# EAGLE design interface_board (2) (EAGLE 6.1)

## Sheet 1 of 4
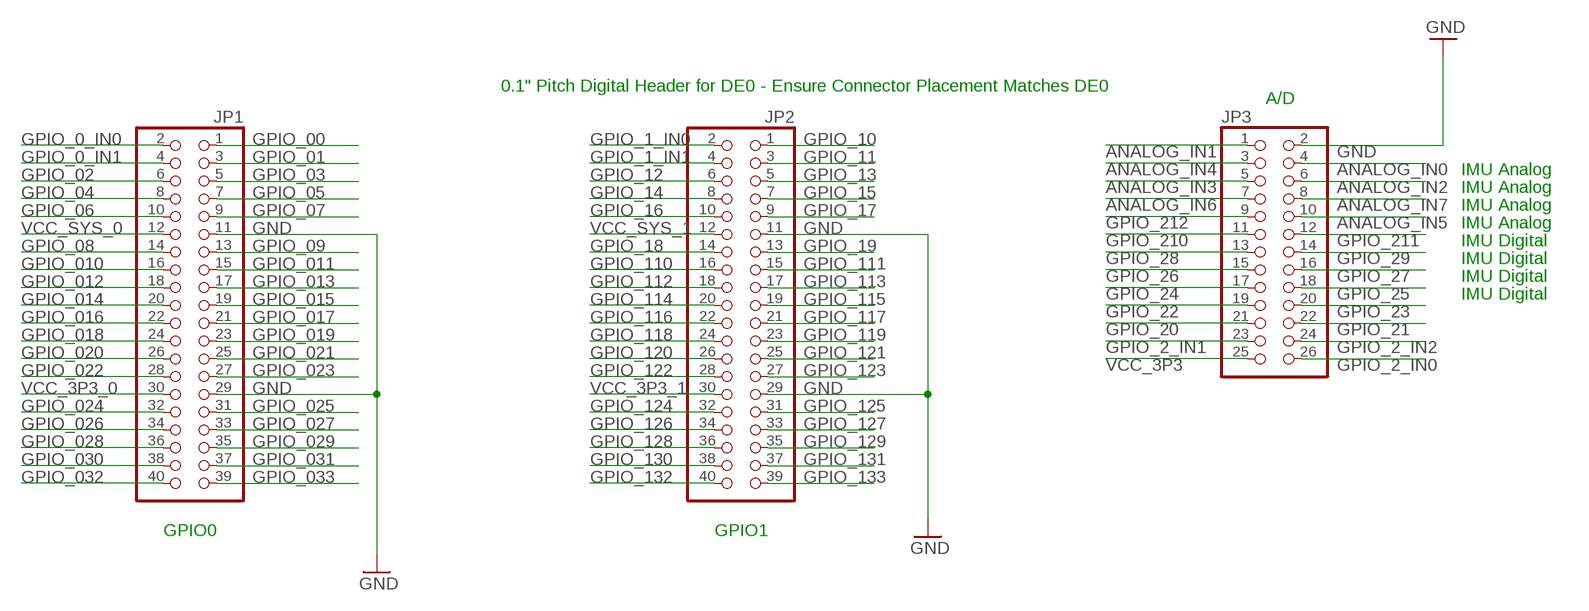
[diagram p0: schematic, sheet 1]

### Parts
JP1  PINHD-2X20  [2X20]
JP2  PINHD-2X20  [2X20]
JP3  PINHD-2X13  [2X13]

### Nets
ANALOG_IN0: JP3.4 ; also sheet 2,3
ANALOG_IN1: JP3.1 ; also sheet 2
ANALOG_IN2: JP3.6 ; also sheet 2,3
ANALOG_IN3: JP3.5 ; also sheet 2
ANALOG_IN4: JP3.3 ; also sheet 2
ANALOG_IN5: JP3.10 ; also sheet 2,3
ANALOG_IN6: JP3.7 ; also sheet 2
ANALOG_IN7: JP3.8 ; also sheet 2,3
GND: JP1.11 JP1.29 JP2.11 JP2.29 JP3.2 ; also sheet 2,3,4
GPIO_00: JP1.1 ; also sheet 2,4
GPIO_0_IN0: JP1.2 ; also sheet 2,4
GPIO_0_IN1: JP1.4 ; also sheet 2
GPIO_01: JP1.3 ; also sheet 2
GPIO_1_IN0: JP2.2 ; also sheet 2
GPIO_1_IN1: JP2.4 ; also sheet 2
GPIO_02: JP1.6 ; also sheet 2
GPIO_2_IN0: JP3.26 ; also sheet 2
GPIO_2_IN1: JP3.23 ; also sheet 2
GPIO_2_IN2: JP3.24 ; also sheet 2
GPIO_03: JP1.5 ; also sheet 2
GPIO_04: JP1.8 ; also sheet 2
GPIO_05: JP1.7 ; also sheet 2
GPIO_06: JP1.10 ; also sheet 2
GPIO_07: JP1.9 ; also sheet 2
GPIO_08: JP1.14 ; also sheet 2
GPIO_09: JP1.13 ; also sheet 2
GPIO_010: JP1.16 ; also sheet 2
GPIO_10: JP2.1 ; also sheet 2
GPIO_011: JP1.15 ; also sheet 2
GPIO_11: JP2.3 ; also sheet 2
GPIO_012: JP1.18 ; also sheet 2
GPIO_12: JP2.6 ; also sheet 2
GPIO_013: JP1.17 ; also sheet 2
GPIO_13: JP2.5 ; also sheet 2
GPIO_014: JP1.20 ; also sheet 2
GPIO_14: JP2.8 ; also sheet 2
GPIO_015: JP1.19 ; also sheet 2
GPIO_15: JP2.7 ; also sheet 2
GPIO_016: JP1.22 ; also sheet 2
GPIO_16: JP2.10 ; also sheet 2
GPIO_017: JP1.21 ; also sheet 2
GPIO_17: JP2.9 ; also sheet 2
GPIO_018: JP1.24 ; also sheet 2
GPIO_18: JP2.14 ; also sheet 2
GPIO_019: JP1.23 ; also sheet 2
GPIO_19: JP2.13 ; also sheet 2
GPIO_020: JP1.26 ; also sheet 2
GPIO_20: JP3.21 ; also sheet 2
GPIO_021: JP1.25 ; also sheet 2
GPIO_21: JP3.22 ; also sheet 2
GPIO_022: JP1.28 ; also sheet 2
GPIO_22: JP3.19 ; also sheet 2
GPIO_023: JP1.27 ; also sheet 2
GPIO_23: JP3.20 ; also sheet 2
GPIO_024: JP1.32 ; also sheet 2
GPIO_24: JP3.17 ; also sheet 2
GPIO_025: JP1.31 ; also sheet 2
GPIO_25: JP3.18 ; also sheet 2,3
GPIO_026: JP1.34 ; also sheet 2
GPIO_26: JP3.15 ; also sheet 2
GPIO_027: JP1.33 ; also sheet 2
GPIO_27: JP3.16 ; also sheet 2,3
GPIO_028: JP1.36 ; also sheet 2
GPIO_28: JP3.13 ; also sheet 2
GPIO_029: JP1.35 ; also sheet 2
GPIO_29: JP3.14 ; also sheet 2,3
GPIO_030: JP1.38 ; also sheet 2
GPIO_031: JP1.37 ; also sheet 2
GPIO_032: JP1.40 ; also sheet 2
GPIO_033: JP1.39 ; also sheet 2
GPIO_110: JP2.16 ; also sheet 2
GPIO_111: JP2.15 ; also sheet 2
GPIO_112: JP2.18 ; also sheet 2
GPIO_113: JP2.17 ; also sheet 2
GPIO_114: JP2.20 ; also sheet 2
GPIO_115: JP2.19 ; also sheet 2
GPIO_116: JP2.22 ; also sheet 2
GPIO_117: JP2.21 ; also sheet 2
GPIO_118: JP2.24 ; also sheet 2
GPIO_119: JP2.23 ; also sheet 2
GPIO_120: JP2.26 ; also sheet 2
GPIO_121: JP2.25 ; also sheet 2
GPIO_122: JP2.28 ; also sheet 2
GPIO_123: JP2.27 ; also sheet 2
GPIO_124: JP2.32 ; also sheet 2,4
GPIO_125: JP2.31 ; also sheet 4
GPIO_126: JP2.34 ; also sheet 3
GPIO_127: JP2.33 ; also sheet 4
GPIO_128: JP2.36 ; also sheet 3
GPIO_129: JP2.35 ; also sheet 4
GPIO_130: JP2.38 ; also sheet 3
GPIO_131: JP2.37 ; also sheet 4
GPIO_132: JP2.40 ; also sheet 3
GPIO_133: JP2.39 ; also sheet 4
GPIO_210: JP3.11 ; also sheet 2
GPIO_211: JP3.12 ; also sheet 2,3
GPIO_212: JP3.9 ; also sheet 2
VCC_3P3: JP3.25 ; also sheet 3
VCC_3P3_0: JP1.30
VCC_3P3_1: JP2.30 ; also sheet 4
VCC_SYS_0: JP1.12
VCC_SYS_1: JP2.12

### Notes on the sheet
- 0.1" Pitch Digital Header for DE0 - Ensure Connector Placement Matches DE0 | A/D
- IMU Analog
- IMU Analog
- IMU Analog
- IMU Analog
- IMU Digital
- IMU Digital
- IMU Digital
- IMU Digital
- GPIO0 | GPIO1

## Sheet 2 of 4
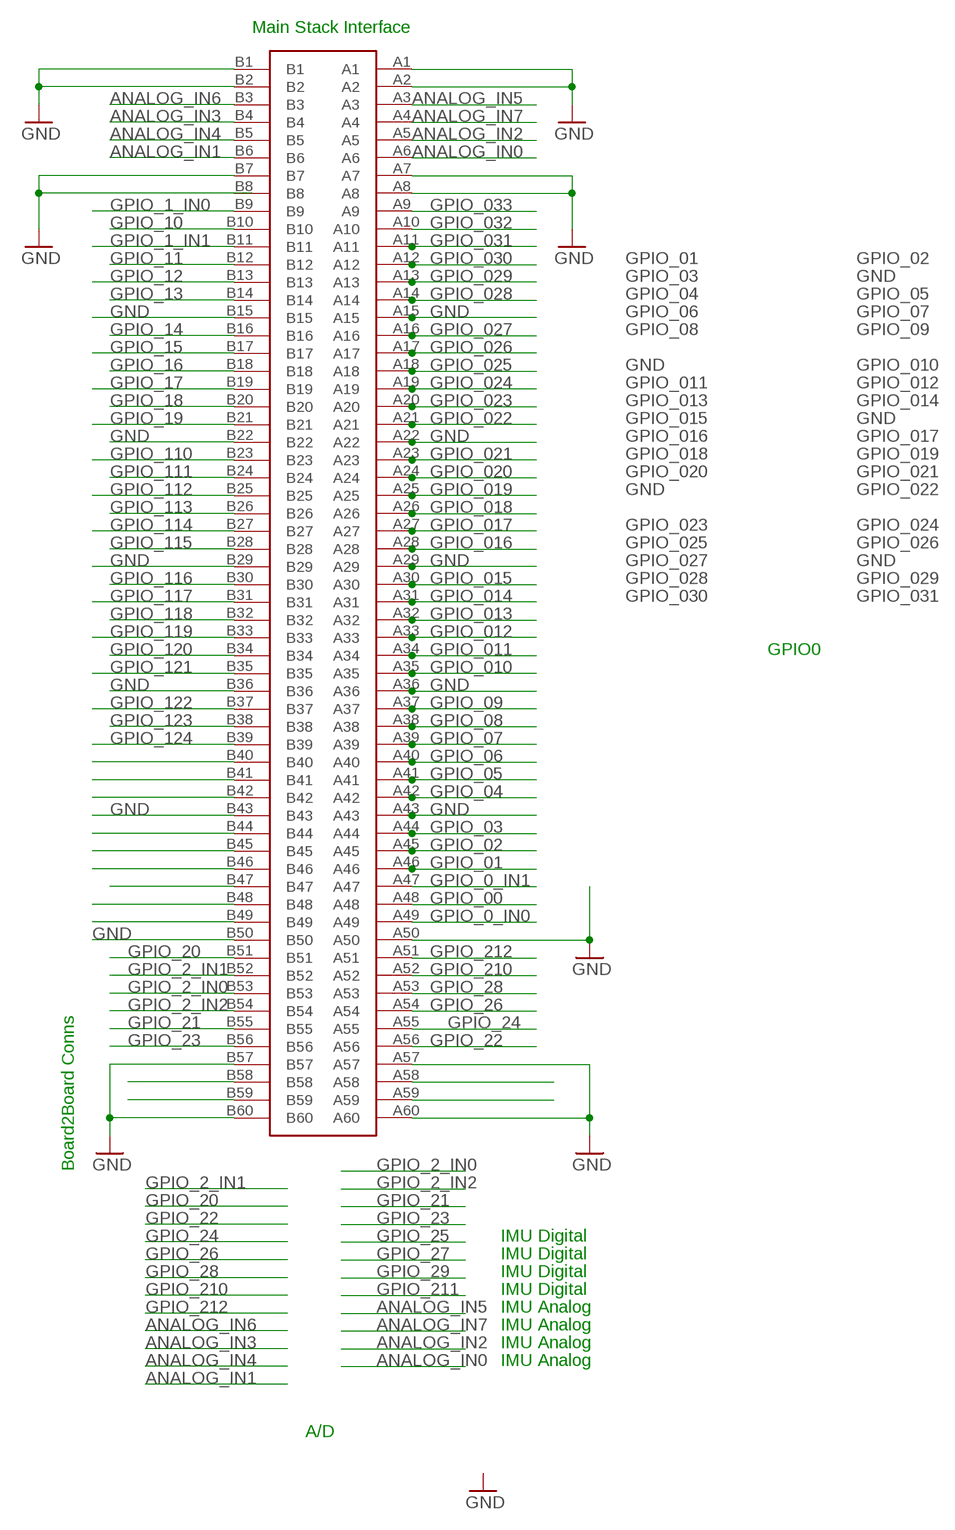
[diagram p1: schematic, sheet 2]

### Parts
U$10  MAIN-STACK-CONN-WIDEPITCH  [STACK-CONN-WIDEPITCH]

### Nets
ANALOG_IN0: U$10.A6 ; also sheet 1,3
ANALOG_IN1: U$10.B6 ; also sheet 1
ANALOG_IN2: U$10.A5 ; also sheet 1,3
ANALOG_IN3: U$10.B4 ; also sheet 1
ANALOG_IN4: U$10.B5 ; also sheet 1
ANALOG_IN5: U$10.A3 ; also sheet 1,3
ANALOG_IN6: U$10.B3 ; also sheet 1
ANALOG_IN7: U$10.A4 ; also sheet 1,3
GND: U$10.A1 U$10.A2 U$10.A7 U$10.A8 U$10.A15 U$10.A22 U$10.A29 U$10.A36 U$10.A43 U$10.A50 U$10.A57 U$10.A60 U$10.B1 U$10.B2 U$10.B7 U$10.B15 U$10.B22 U$10.B29 U$10.B36 U$10.B43 U$10.B50 U$10.B57 U$10.B60 ; also sheet 1,3,4
GPIO_00: U$10.A48 ; also sheet 1,4
GPIO_0_IN0: U$10.A49 ; also sheet 1,4
GPIO_0_IN1: U$10.A47 ; also sheet 1
GPIO_01: U$10.A46 ; also sheet 1
GPIO_1_IN0: U$10.B9 ; also sheet 1
GPIO_1_IN1: U$10.B11 ; also sheet 1
GPIO_02: U$10.A45 ; also sheet 1
GPIO_2_IN0: U$10.B53 ; also sheet 1
GPIO_2_IN1: U$10.B52 ; also sheet 1
GPIO_2_IN2: U$10.B54 ; also sheet 1
GPIO_03: U$10.A44 ; also sheet 1
GPIO_04: U$10.A42 ; also sheet 1
GPIO_05: U$10.A41 ; also sheet 1
GPIO_06: U$10.A40 ; also sheet 1
GPIO_07: U$10.A39 ; also sheet 1
GPIO_08: U$10.A38 ; also sheet 1
GPIO_09: U$10.A37 ; also sheet 1
GPIO_010: U$10.A35 ; also sheet 1
GPIO_10: U$10.B10 ; also sheet 1
GPIO_011: U$10.A34 ; also sheet 1
GPIO_11: U$10.B12 ; also sheet 1
GPIO_012: U$10.A33 ; also sheet 1
GPIO_12: U$10.B13 ; also sheet 1
GPIO_013: U$10.A32 ; also sheet 1
GPIO_13: U$10.B14 ; also sheet 1
GPIO_014: U$10.A31 ; also sheet 1
GPIO_14: U$10.B16 ; also sheet 1
GPIO_015: U$10.A30 ; also sheet 1
GPIO_15: U$10.B17 ; also sheet 1
GPIO_016: U$10.A28 ; also sheet 1
GPIO_16: U$10.B18 ; also sheet 1
GPIO_017: U$10.A27 ; also sheet 1
GPIO_17: U$10.B19 ; also sheet 1
GPIO_018: U$10.A26 ; also sheet 1
GPIO_18: U$10.B20 ; also sheet 1
GPIO_019: U$10.A25 ; also sheet 1
GPIO_19: U$10.B21 ; also sheet 1
GPIO_020: U$10.A24 ; also sheet 1
GPIO_20: U$10.B51 ; also sheet 1
GPIO_021: U$10.A23 ; also sheet 1
GPIO_21: U$10.B55 ; also sheet 1
GPIO_022: U$10.A21 ; also sheet 1
GPIO_22: U$10.A56 ; also sheet 1
GPIO_023: U$10.A20 ; also sheet 1
GPIO_23: U$10.B56 ; also sheet 1
GPIO_024: U$10.A19 ; also sheet 1
GPIO_24: U$10.A55 ; also sheet 1
GPIO_025: U$10.A18 ; also sheet 1
GPIO_026: U$10.A17 ; also sheet 1
GPIO_26: U$10.A54 ; also sheet 1
GPIO_027: U$10.A16 ; also sheet 1
GPIO_028: U$10.A14 ; also sheet 1
GPIO_28: U$10.A53 ; also sheet 1
GPIO_029: U$10.A13 ; also sheet 1
GPIO_030: U$10.A12 ; also sheet 1
GPIO_031: U$10.A11 ; also sheet 1
GPIO_032: U$10.A10 ; also sheet 1
GPIO_033: U$10.A9 ; also sheet 1
GPIO_110: U$10.B23 ; also sheet 1
GPIO_111: U$10.B24 ; also sheet 1
GPIO_112: U$10.B25 ; also sheet 1
GPIO_113: U$10.B26 ; also sheet 1
GPIO_114: U$10.B27 ; also sheet 1
GPIO_115: U$10.B28 ; also sheet 1
GPIO_116: U$10.B30 ; also sheet 1
GPIO_117: U$10.B31 ; also sheet 1
GPIO_118: U$10.B32 ; also sheet 1
GPIO_119: U$10.B33 ; also sheet 1
GPIO_120: U$10.B34 ; also sheet 1
GPIO_121: U$10.B35 ; also sheet 1
GPIO_122: U$10.B37 ; also sheet 1
GPIO_123: U$10.B38 ; also sheet 1
GPIO_124: U$10.B39 ; also sheet 1,4
GPIO_210: U$10.A52 ; also sheet 1
GPIO_212: U$10.A51 ; also sheet 1
N$4: U$10.B58
N$5: U$10.B59
N$6: U$10.A59
N$7: U$10.A58
N$15: U$10.B40
N$16: U$10.B41
N$17: U$10.B42
N$18: U$10.B44
N$19: U$10.B45
N$20: U$10.B46
N$21: U$10.B47
N$22: U$10.B48
N$23: U$10.B49
Unconnected: U$10.B8

### Notes on the sheet
- Main Stack Interface
- GPIO0
- Board2Board Conns
- IMU Digital
- IMU Digital
- IMU Digital
- IMU Digital
- IMU Analog
- IMU Analog
- IMU Analog
- IMU Analog
- A/D

## Sheet 3 of 4
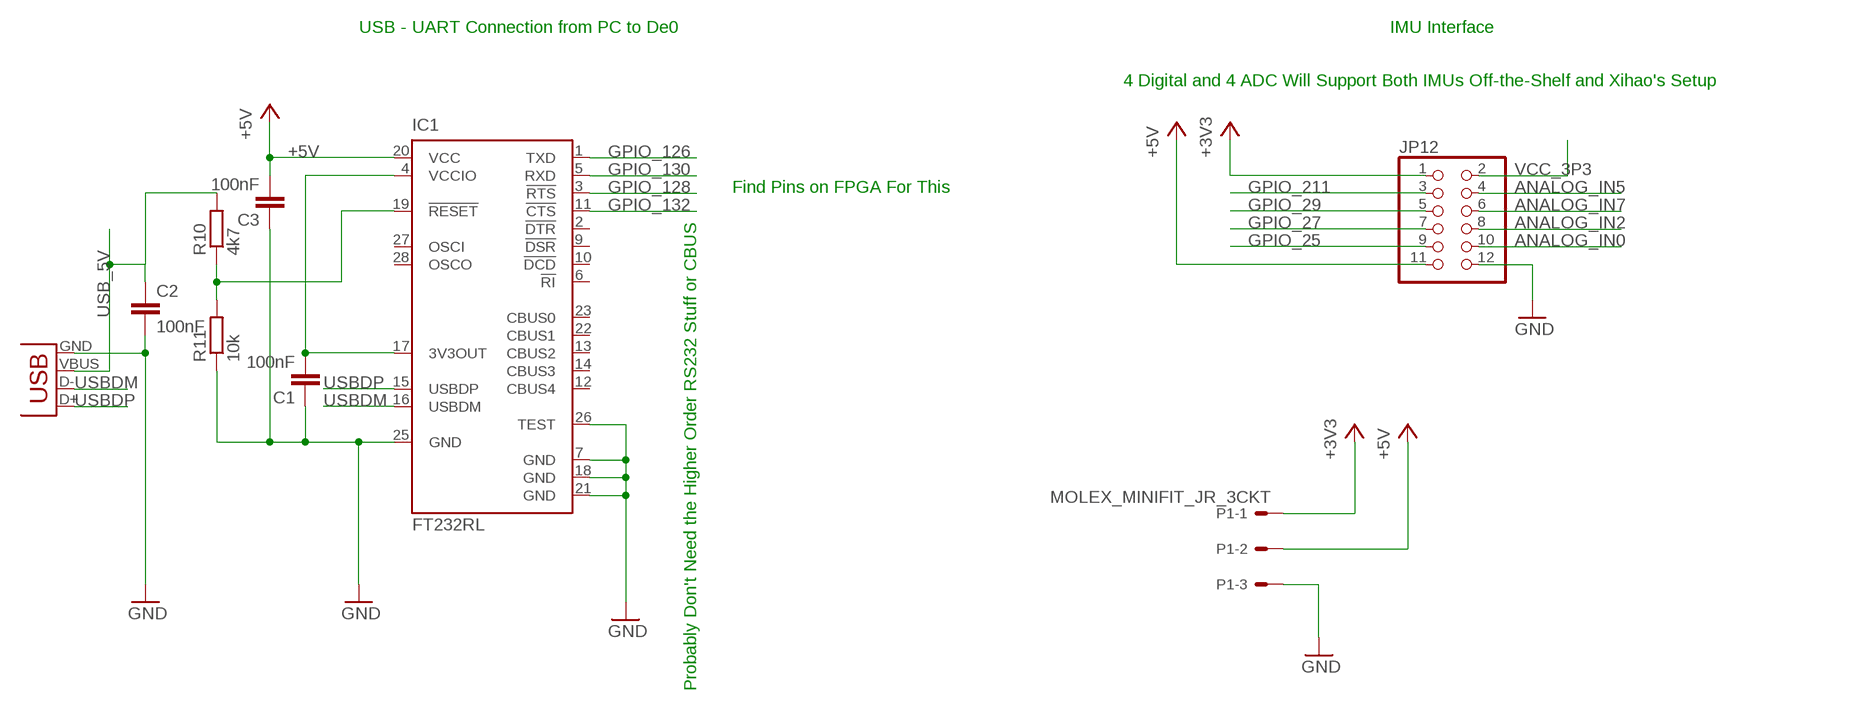
[diagram p2: schematic, sheet 3]

### Parts
C1  100nF  C-EUC0805  [C0805]
C2  100nF  C-EUC0805  [C0805]
C3  100nF  C-EUC0805  [C0805]
IC1  FT232RL  [SSOP28]
JP12  PINHD-2X6  [2X06]
P1  MOLEX_MINIFIT_JR_3CKT  [3CKT_MINIFIT_JR]
R10  4k7  R-EU_M0805  [M0805]
R11  10k  R-EU_M0805  [M0805]
X1  USBSMD  [USB-MINIB]

### Nets
+3V3: JP12.1 P1.1 ; also sheet 4
+5V: C3.2 IC1.20(VCC) JP12.11 P1.2
ANALOG_IN0: JP12.10 ; also sheet 1,2
ANALOG_IN2: JP12.8 ; also sheet 1,2
ANALOG_IN5: JP12.4 ; also sheet 1,2
ANALOG_IN7: JP12.6 ; also sheet 1,2
GND: C1.1 C2.2 C3.1 IC1.7(GND) IC1.18(GND) IC1.21(GND) IC1.25(GND) IC1.26(TEST) JP12.12 P1.3 R11.1 X1.GND ; also sheet 1,2,4
GPIO_25: JP12.9 ; also sheet 1,2
GPIO_27: JP12.7 ; also sheet 1,2
GPIO_29: JP12.5 ; also sheet 1,2
GPIO_126: IC1.1(TXD) ; also sheet 1
GPIO_128: IC1.3(!RTS) ; also sheet 1
GPIO_130: IC1.5(RXD) ; also sheet 1
GPIO_132: IC1.11(!CTS) ; also sheet 1
GPIO_211: JP12.3 ; also sheet 1,2
N$1: C1.2 IC1.4(VCCIO) IC1.17(3V3OUT)
N$27: IC1.19(!RESET) R10.1 R11.2
USB_5V: C2.1 R10.2 X1.VBUS
USBDM: IC1.16(USBDM) X1.D-
USBDP: IC1.15(USBDP) X1.D+
VCC_3P3: JP12.2 ; also sheet 1
Unconnected: IC1.2(!DTR) IC1.6(!RI) IC1.9(!DSR) IC1.10(!DCD) IC1.12(CBUS4) IC1.13(CBUS2) IC1.14(CBUS3) IC1.22(CBUS1) IC1.23(CBUS0) IC1.27(OSCI) IC1.28(OSCO)

### Notes on the sheet
- USB - UART Connection from PC to De0 | IMU Interface
- 4 Digital and 4 ADC Will Support Both IMUs Off-the-Shelf and Xihao's Setup
- Find Pins on FPGA For This
- Probably Don't Need the Higher Order RS232 Stuff or CBUS

## Sheet 4 of 4
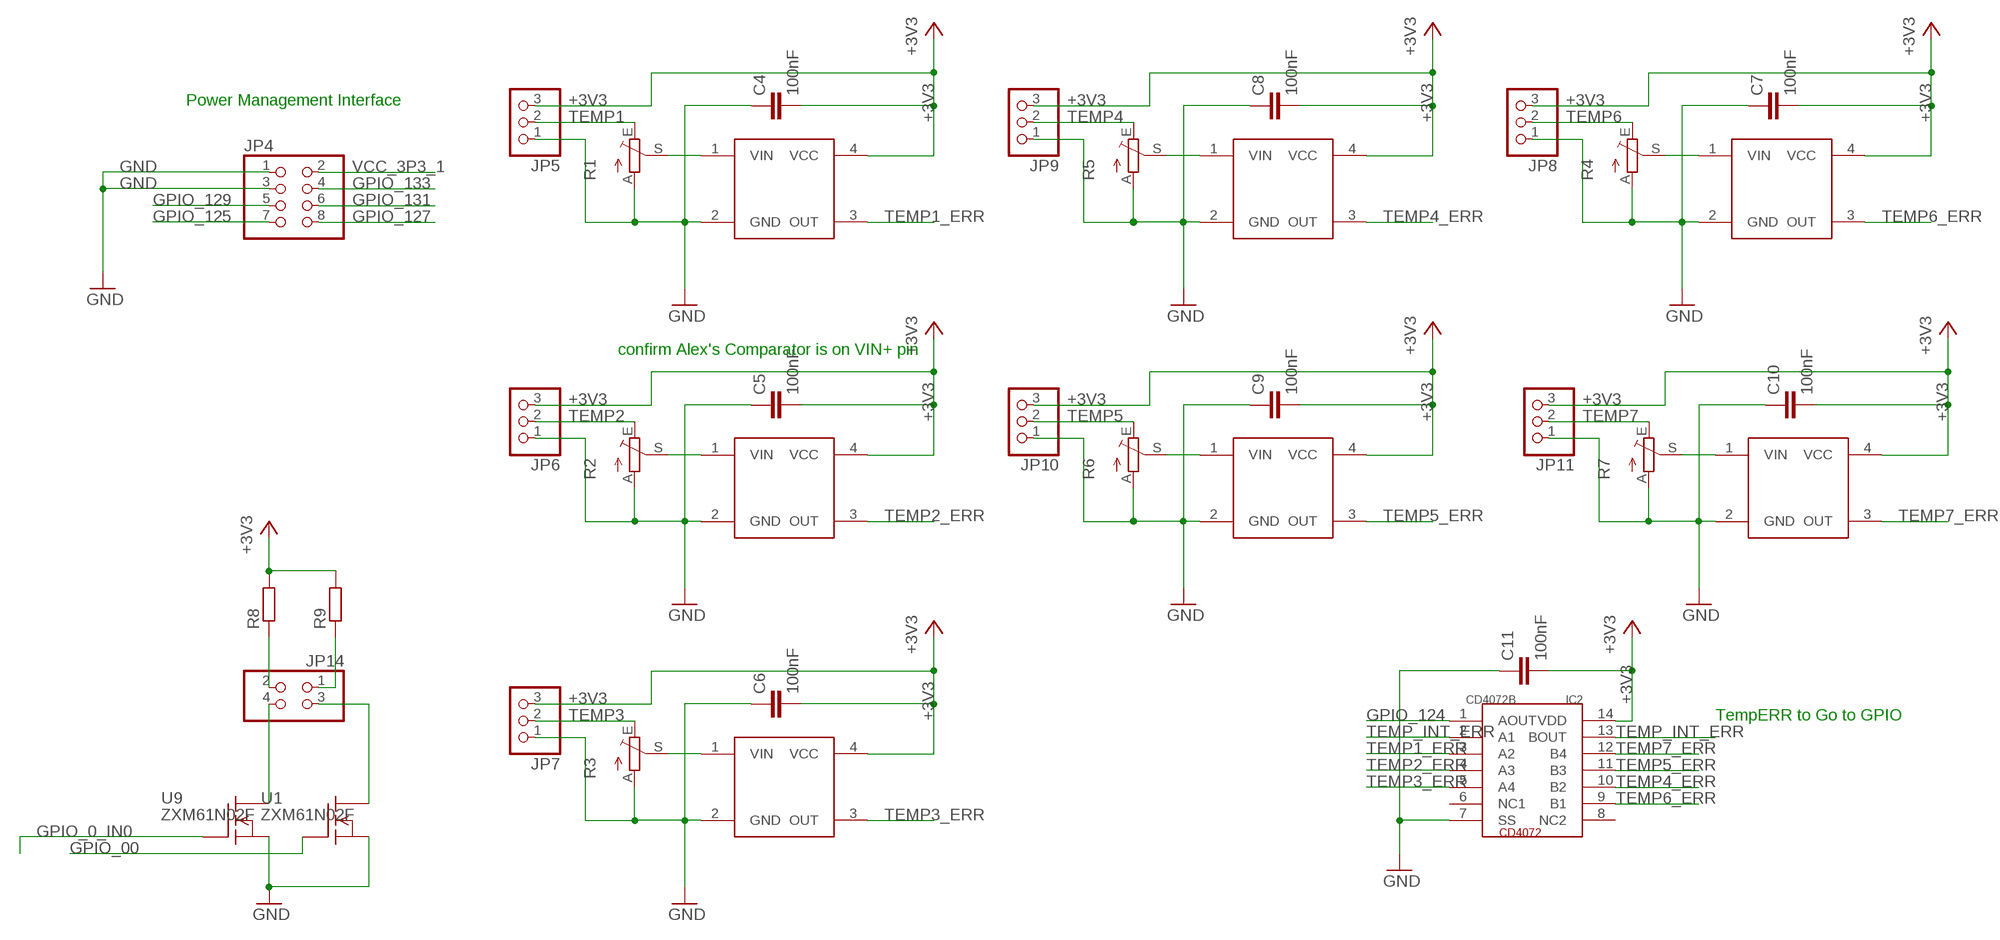
[diagram p3: schematic, sheet 4]

### Parts
C4  100nF  C-EUC0805  [C0805]
C5  100nF  C-EUC0805  [C0805]
C6  100nF  C-EUC0805  [C0805]
C7  100nF  C-EUC0805  [C0805]
C8  100nF  C-EUC0805  [C0805]
C9  100nF  C-EUC0805  [C0805]
C10  100nF  C-EUC0805  [C0805]
C11  100nF  C-EUC0805  [C0805]
IC2  CD4072B  [SO14]
JP4  PINHD-2X4  [2X04]
JP5  PINHD-1X3  [1X03]
JP6  PINHD-1X3  [1X03]
JP7  PINHD-1X3  [1X03]
JP8  PINHD-1X3  [1X03]
JP9  PINHD-1X3  [1X03]
JP10  PINHD-1X3  [1X03]
JP11  PINHD-1X3  [1X03]
JP14  PINHD-2X2  [2X02]
R1  TRIM_1234-S64YW  [POT]
R2  TRIM_1234-S64YW  [POT]
R3  TRIM_1234-S64YW  [POT]
R4  TRIM_1234-S64YW  [POT]
R5  TRIM_1234-S64YW  [POT]
R6  TRIM_1234-S64YW  [POT]
R7  TRIM_1234-S64YW  [POT]
R8  R-EU_M1206  [M1206]
R9  R-EU_M1206  [M1206]
U1  ZXM61N02F  [SOT23W]
U9  ZXM61N02F  [SOT23W]
U$2  ADCMP  [ADCMP]
U$4  ADCMP  [ADCMP]
U$5  ADCMP  [ADCMP]
U$6  ADCMP  [ADCMP]
U$7  ADCMP  [ADCMP]
U$8  ADCMP  [ADCMP]
U$9  ADCMP  [ADCMP]

### Nets
+3V3: C4.2 C5.2 C6.2 C7.2 C8.2 C9.2 C10.2 C11.2 IC2.14(VDD) JP5.3 JP6.3 JP7.3 JP8.3 JP9.3 JP10.3 JP11.3 R8.2 R9.2 U$2.4(VCC) U$4.4(VCC) U$5.4(VCC) U$6.4(VCC) U$7.4(VCC) U$8.4(VCC) U$9.4(VCC) ; also sheet 3
GND: C4.1 C5.1 C6.1 C7.1 C8.1 C9.1 C10.1 C11.1 IC2.7(SS) JP4.1 JP4.3 JP5.1 JP6.1 JP7.1 JP8.1 JP9.1 JP10.1 JP11.1 R1.A R2.A R3.A R4.A R5.A R6.A R7.A U1.2(S) U9.2(S) U$2.2(GND) U$4.2(GND) U$5.2(GND) U$6.2(GND) U$7.2(GND) U$8.2(GND) U$9.2(GND) ; also sheet 1,2,3
GPIO_00: U1.1(G) ; also sheet 1,2
GPIO_0_IN0: U9.1(G) ; also sheet 1,2
GPIO_124: IC2.1(AOUT) ; also sheet 1,2
GPIO_125: JP4.7 ; also sheet 1
GPIO_127: JP4.8 ; also sheet 1
GPIO_129: JP4.5 ; also sheet 1
GPIO_131: JP4.6 ; also sheet 1
GPIO_133: JP4.4 ; also sheet 1
N$2: R1.S U$2.1(VIN)
N$3: R2.S U$4.1(VIN)
N$8: R3.S U$5.1(VIN)
N$9: R4.S U$6.1(VIN)
N$10: R5.S U$7.1(VIN)
N$11: R6.S U$8.1(VIN)
N$12: R7.S U$9.1(VIN)
N$13: JP14.2 R8.1
N$14: JP14.4 U9.3(D)
N$24: JP14.1 R9.1
N$25: JP14.3 U1.3(D)
TEMP1: JP5.2 R1.E
TEMP1_ERR: IC2.3(A2) U$2.3(OUT)
TEMP2: JP6.2 R2.E
TEMP2_ERR: IC2.4(A3) U$4.3(OUT)
TEMP3: JP7.2 R3.E
TEMP3_ERR: IC2.5(A4) U$5.3(OUT)
TEMP4: JP9.2 R5.E
TEMP4_ERR: IC2.10(B2) U$7.3(OUT)
TEMP5: JP10.2 R6.E
TEMP5_ERR: IC2.11(B3) U$8.3(OUT)
TEMP6: JP8.2 R4.E
TEMP6_ERR: IC2.9(B1) U$6.3(OUT)
TEMP7: JP11.2 R7.E
TEMP7_ERR: IC2.12(B4) U$9.3(OUT)
TEMP_INT_ERR: IC2.2(A1) IC2.13(BOUT)
VCC_3P3_1: JP4.2 ; also sheet 1
Unconnected: IC2.6(NC1) IC2.8(NC2) R1.S@1(S) R2.S@1(S) R3.S@1(S) R4.S@1(S) R5.S@1(S) R6.S@1(S) R7.S@1(S)

### Notes on the sheet
- Power Management Interface
- confirm Alex's Comparator is on VIN+ pin
- TempERR to Go to GPIO

## Library data of the parts
C1-C11 = rcl:C-EU: CAPACITOR, European symbol
IC1 = ftdichip:FT232R: Source: http://www.ftdichip.com/Documents/DataSheets/DS_FT232R_v104.pdf
IC2 = interface:CD4072B
JP1 JP2 = pinhead:PINHD-2X20: PIN HEADER
JP3 = pinhead:PINHD-2X13: PIN HEADER
JP4 = pinhead:PINHD-2X4: PIN HEADER
JP5-JP11 = pinhead:PINHD-1X3: PIN HEADER
JP12 = pinhead:PINHD-2X6: PIN HEADER
JP14 = pinhead:PINHD-2X2: PIN HEADER
P1 = Motor Driver Custom:MOLEX_MINIFIT_JR_3CKT
R1-R7 = epvParts:TRIM_1234-: POTENTIOMETER
R8-R11 = rcl:R-EU_: RESISTOR, European symbol
U1 U9 = PowerManagementBoard:ZXM61N02F: N-Ch Enhancement MOSFET, Logic Level (SOT23)
U$2 U$4-U$9 = comparator:ADCMP
U$10 = interface:MAIN-STACK-CONN-WIDEPITCH
X1 = SparkFun:USB: USB Connectors USB-B-PTH is fully proven SKU : PRT-00139 USB-miniB is fully proven SKU : PRT-00587 USB-A-PCB is untested. USB-A-H is throughly reviewed, but untested. Spark Fun Electronics SKU : PRT-00437 USB-B-SMT is throughly reviewed, but untested. Needs silkscreen touching up. USB-A-S has not been used/tested USB-MB-H has not been used/tested

## Board
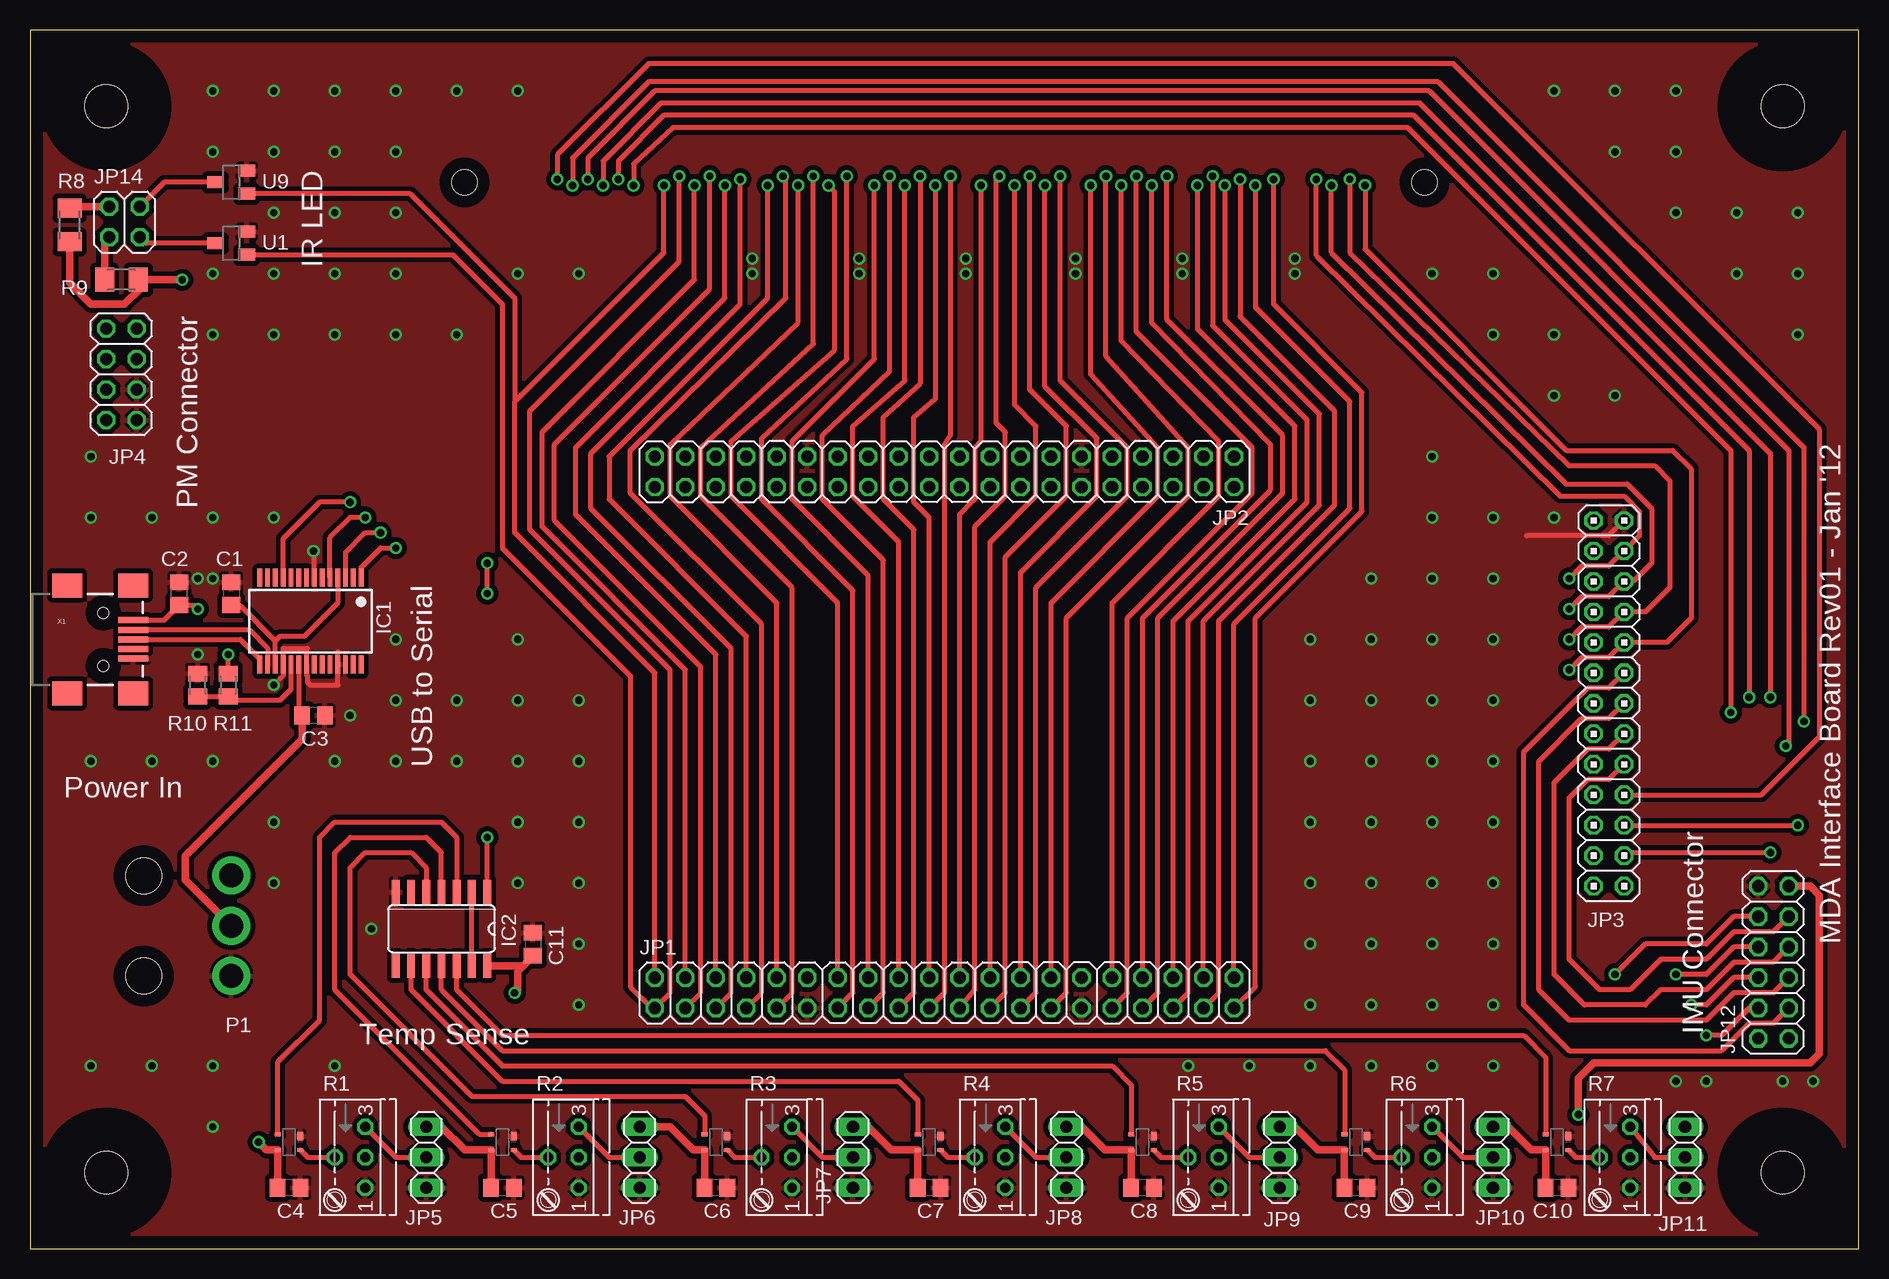
[diagram p4: board, top side]
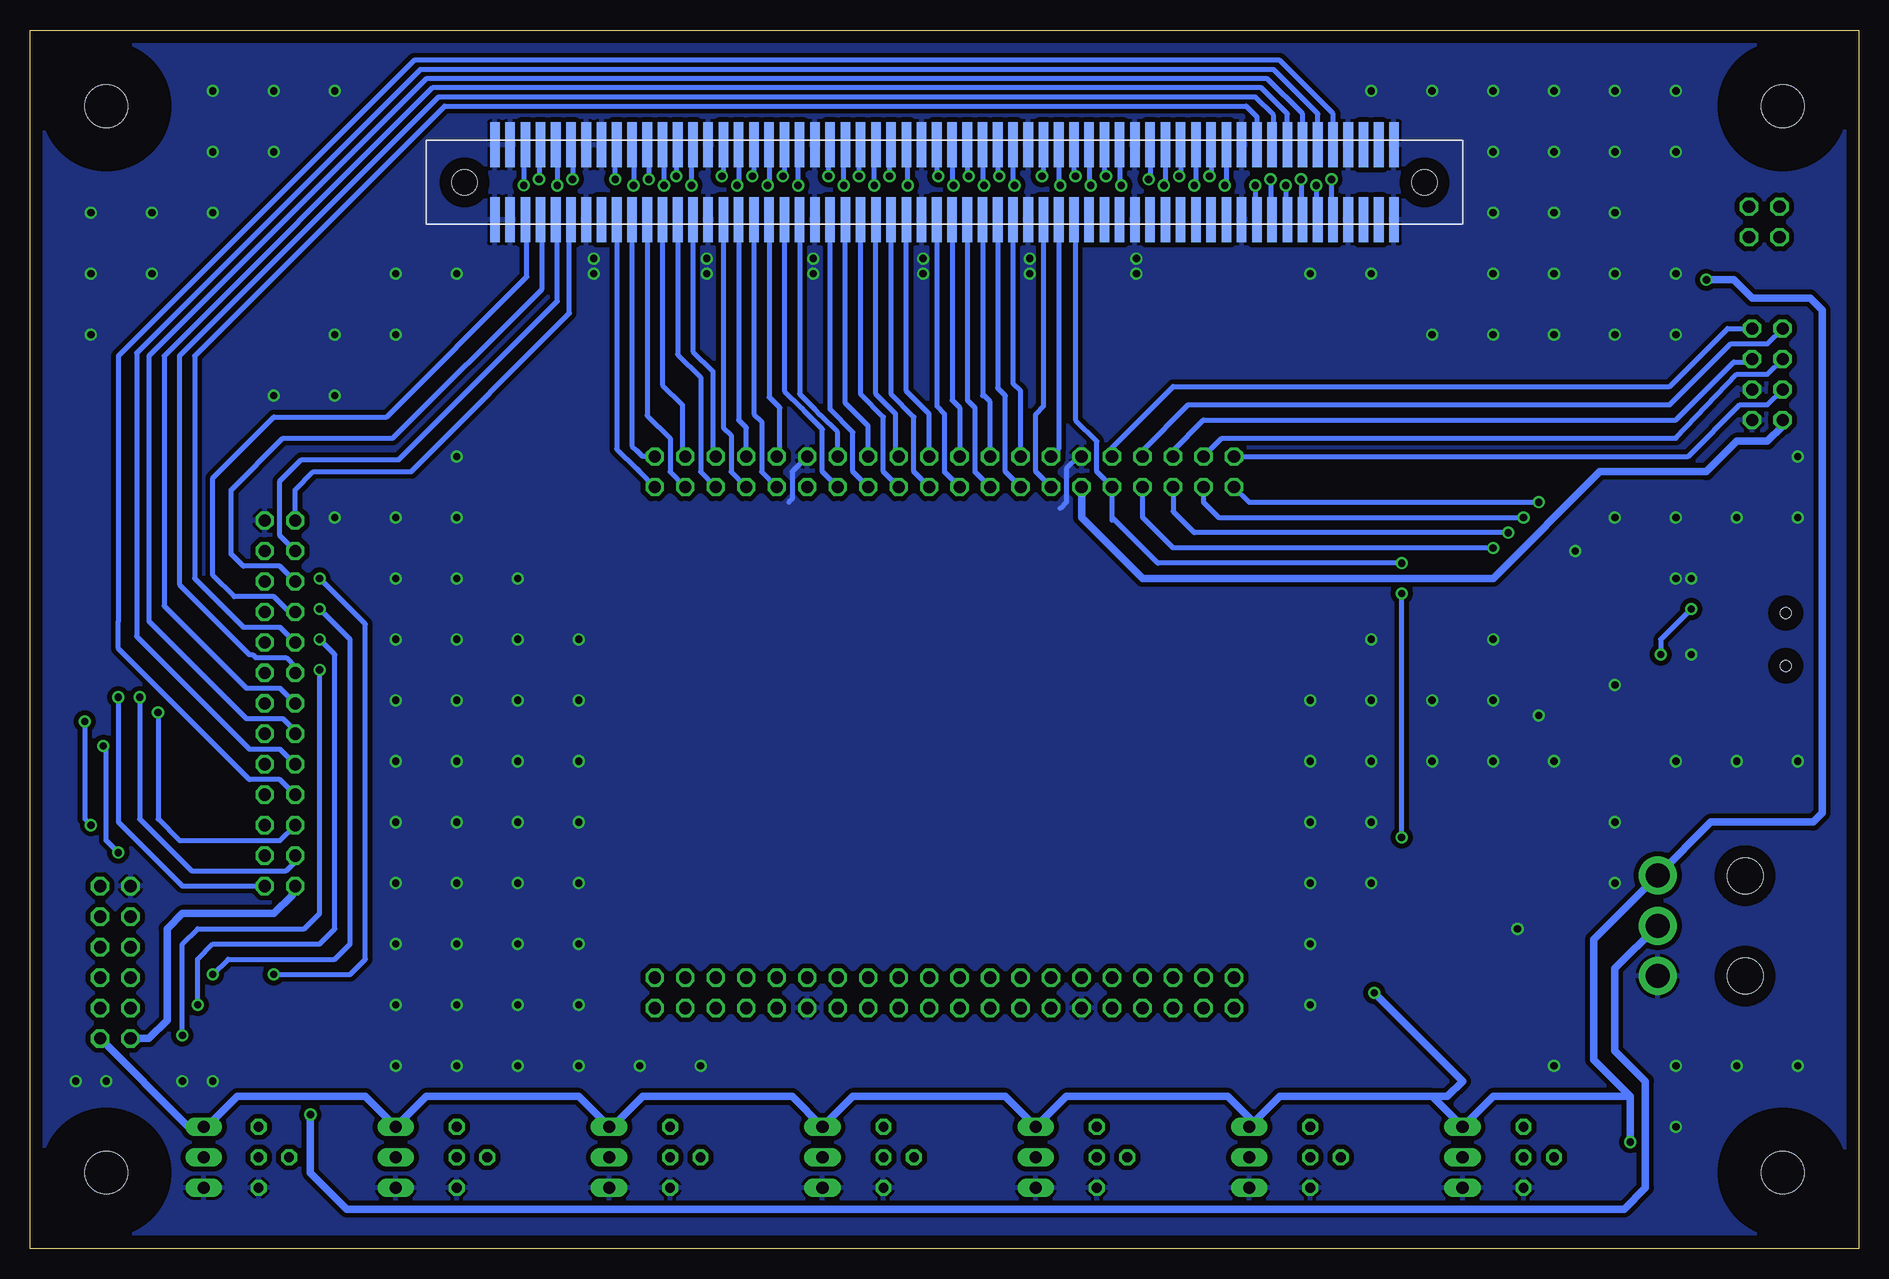
[diagram p5: board, bottom side, seen from below]

Size 152.4 x 101.6 mm. Coordinates in mm from the lower left corner, seen from the top.
Outline: 0,0 152.4,0 152.4,101.6 0,101.6 0,0
Copper layers (1*16): Top 0.035mm / dielectric 1.5mm / Bottom 0.035mm
Design rules: minimum track width 10mil, minimum drill 24mil, track to track 8mil, track to pad 8mil, pad to pad 8mil, via to via 8mil, smd to smd 8mil, copper to edge 40mil, drill to drill 20mil, minimum pad ring 10mil, minimum via ring 8mil, stop-mask expansion 4mil, vias tented up to drill 0mil, thermal gap 10mil
Holes 3.56 mm at 146.05,6.35 146.05,95.25 6.35,95.25 6.35,6.35
tRestrict: area 1.6,90.5 to 11.1,100; area 141.3,90.5 to 150.8,100; area 141.3,1.6 to 150.8,11.1; area 1.6,1.6 to 11.1,11.1
bRestrict: area 1.6,1.6 to 11.1,11.1; area 1.6,90.5 to 11.1,100; area 141.3,90.5 to 150.8,100; area 141.3,1.6 to 150.8,11.1

### Footprints (pad centres in the part's own frame; a part is rotated, then mirrored left to right if it is on the bottom)
C0805 = smd 1.3 x 1.5: 1 -0.95,0; 2 0.95,0
SSOP28 = smd 0.4 x 1.5: 1 -4.225,-3.625; 2 -3.575,-3.625; 3 -2.925,-3.625; 4 -2.275,-3.625; 5 -1.625,-3.625; 6 -0.975,-3.625; 7 -0.325,-3.625; 8 0.325,-3.625; 9 0.975,-3.625; 10 1.625,-3.625; 11 2.275,-3.625; 12 2.925,-3.625; 13 3.575,-3.625; 14 4.225,-3.625; 15 4.225,3.625; 16 3.575,3.625; 17 2.925,3.625; 18 2.275,3.625; 19 1.625,3.625; 20 0.975,3.625; 21 0.325,3.625; 22 -0.325,3.625; 23 -0.975,3.625; 24 -1.625,3.625; 25 -2.275,3.625; 26 -2.925,3.625; 27 -3.575,3.625; 28 -4.225,3.625
SO14 = smd 0.66 x 2.032: 1 -3.81,-3.073; 2 -2.54,-3.073; 3 -1.27,-3.073; 4 0,-3.073; 5 1.27,-3.073; 6 2.54,-3.073; 7 3.81,-3.073; 8 3.81,3.073; 9 2.54,3.073; 10 1.27,3.073; 11 0,3.073; 12 -1.27,3.073; 13 -2.54,3.073; 14 -3.81,3.073
2X20 = drill 1.016 octagon: 1 -24.13,-1.27; 2 -24.13,1.27; 3 -21.59,-1.27; 4 -21.59,1.27; 5 -19.05,-1.27; 6 -19.05,1.27; 7 -16.51,-1.27; 8 -16.51,1.27; 9 -13.97,-1.27; 10 -13.97,1.27; 11 -11.43,-1.27; 12 -11.43,1.27; 13 -8.89,-1.27; 14 -8.89,1.27; 15 -6.35,-1.27; 16 -6.35,1.27; 17 -3.81,-1.27; 18 -3.81,1.27; 19 -1.27,-1.27; 20 -1.27,1.27; 21 1.27,-1.27; 22 1.27,1.27; 23 3.81,-1.27; 24 3.81,1.27; 25 6.35,-1.27; 26 6.35,1.27; 27 8.89,-1.27; 28 8.89,1.27; 29 11.43,-1.27; 30 11.43,1.27; 31 13.97,-1.27; 32 13.97,1.27; 33 16.51,-1.27; 34 16.51,1.27; 35 19.05,-1.27; 36 19.05,1.27; 37 21.59,-1.27; 38 21.59,1.27; 39 24.13,-1.27; 40 24.13,1.27
2X13 = drill 1.016 octagon: 1 -15.24,-1.27; 2 -15.24,1.27; 3 -12.7,-1.27; 4 -12.7,1.27; 5 -10.16,-1.27; 6 -10.16,1.27; 7 -7.62,-1.27; 8 -7.62,1.27; 9 -5.08,-1.27; 10 -5.08,1.27; 11 -2.54,-1.27; 12 -2.54,1.27; 13 0,-1.27; 14 0,1.27; 15 2.54,-1.27; 16 2.54,1.27; 17 5.08,-1.27; 18 5.08,1.27; 19 7.62,-1.27; 20 7.62,1.27; 21 10.16,-1.27; 22 10.16,1.27; 23 12.7,-1.27; 24 12.7,1.27; 25 15.24,-1.27; 26 15.24,1.27
2X04 = drill 1.016 octagon: 1 -3.81,-1.27; 2 -3.81,1.27; 3 -1.27,-1.27; 4 -1.27,1.27; 5 1.27,-1.27; 6 1.27,1.27; 7 3.81,-1.27; 8 3.81,1.27
1X03 = drill 1.016 long: 1 -2.54,0; 2 0,0; 3 2.54,0
2X06 = drill 1.016 octagon: 1 -6.35,-1.27; 2 -6.35,1.27; 3 -3.81,-1.27; 4 -3.81,1.27; 5 -1.27,-1.27; 6 -1.27,1.27; 7 1.27,-1.27; 8 1.27,1.27; 9 3.81,-1.27; 10 3.81,1.27; 11 6.35,-1.27; 12 6.35,1.27
2X02 = drill 1.016 octagon: 1 -1.27,-1.27; 2 -1.27,1.27; 3 1.27,-1.27; 4 1.27,1.27
3CKT_MINIFIT_JR = drill 2 pad 3.175: 1 -4.191,0; 2 0,0; 3 4.191,0 | hole 2.997: -4.166,-7.29; 4.191,-7.29
POT = drill 0.813 octagon: A 2.54,1.27; E -2.54,1.27; S 0,-1.27; S@1 0,1.27
M1206 = smd 1.6 x 2: 1 -1.4,0; 2 1.4,0
M0805 = smd 1.3 x 1.6: 1 -0.95,0; 2 0.95,0
SOT23W = smd 1 x 1.4: 1 -0.95,-1.303; 2 0.95,-1.303; 3 0,1.303
ADCMP = smd 0.3 x 0.525: 1 -0.65,-0.938; 3 0.65,0.938; 4 -0.65,0.938 | smd 0.7 x 0.525: 2 0.5,-0.938
STACK-CONN-WIDEPITCH = smd 0.8 x 3.75: A1 37.465,-3.125; A2 36.195,-3.125; A3 34.925,-3.125; A4 33.655,-3.125; A5 32.385,-3.125; A6 31.115,-3.125; A7 29.845,-3.125; A8 28.575,-3.125; A9 27.305,-3.125; A10 26.035,-3.125; A11 24.765,-3.125; A12 23.495,-3.125; A13 22.225,-3.125; A14 20.955,-3.125; A15 19.685,-3.125; A16 18.415,-3.125; A17 17.145,-3.125; A18 15.875,-3.125; A19 14.605,-3.125; A20 13.335,-3.125; A21 12.065,-3.125; A22 10.795,-3.125; A23 9.525,-3.125; A24 8.255,-3.125; A25 6.985,-3.125; A26 5.715,-3.125; A27 4.445,-3.125; A28 3.175,-3.125; A29 1.905,-3.125; A30 0.635,-3.125; A31 -0.635,-3.125; A32 -1.905,-3.125; A33 -3.175,-3.125; A34 -4.445,-3.125; A35 -5.715,-3.125; A36 -6.985,-3.125; A37 -8.255,-3.125; A38 -9.525,-3.125; A39 -10.795,-3.125; A40 -12.065,-3.125; A41 -13.335,-3.125; A42 -14.605,-3.125; A43 -15.875,-3.125; A44 -17.145,-3.125; A45 -18.415,-3.125; A46 -19.685,-3.125; A47 -20.955,-3.125; A48 -22.225,-3.125; A49 -23.495,-3.125; A50 -24.765,-3.125; A51 -26.035,-3.125; A52 -27.305,-3.125; A53 -28.575,-3.125; A54 -29.845,-3.125; A55 -31.115,-3.125; A56 -32.385,-3.125; A57 -33.655,-3.125; A58 -34.925,-3.125; A59 -36.195,-3.125; A60 -37.465,-3.125; B1 37.465,3.125; B2 36.195,3.125; B3 34.925,3.125; B4 33.655,3.125; B5 32.385,3.125; B6 31.115,3.125; B7 29.845,3.125; B8 28.575,3.125; B9 27.305,3.125; B10 26.035,3.125; B11 24.765,3.125; B12 23.495,3.125; B13 22.225,3.125; B14 20.955,3.125; B15 19.685,3.125; B16 18.415,3.125; B17 17.145,3.125; B18 15.875,3.125; B19 14.605,3.125; B20 13.335,3.125; B21 12.065,3.125; B22 10.795,3.125; B23 9.525,3.125; B24 8.255,3.125; B25 6.985,3.125; B26 5.715,3.125; B27 4.445,3.125; B28 3.175,3.125; B29 1.905,3.125; B30 0.635,3.125; B31 -0.635,3.125; B32 -1.905,3.125; B33 -3.175,3.125; B34 -4.445,3.125; B35 -5.715,3.125; B36 -6.985,3.125; B37 -8.255,3.125; B38 -9.525,3.125; B39 -10.795,3.125; B40 -12.065,3.125; B41 -13.335,3.125; B42 -14.605,3.125; B43 -15.875,3.125; B44 -17.145,3.125; B45 -18.415,3.125; B46 -19.685,3.125; B47 -20.955,3.125; B48 -22.225,3.125; B49 -23.495,3.125; B50 -24.765,3.125; B51 -26.035,3.125; B52 -27.305,3.125; B53 -28.575,3.125; B54 -29.845,3.125; B55 -31.115,3.125; B56 -32.385,3.125; B57 -33.655,3.125; B58 -34.925,3.125; B59 -36.195,3.125; B60 -37.465,3.125 | hole 2.1: -40,0; 40,0
USB-MINIB = smd 2.5 x 0.5: D+ 2.5,0; D- 2.5,0.8; GND 2.5,-1.6; ID 2.5,-0.8; VBUS 2.5,1.6 | smd 2.5 x 2: MTN1 -3,4.5; MTN2 2.5,4.5; MTN3 -3,-4.5; MTN4 2.5,-4.5 | hole 0.9: 0,2.2; 0,-2.2

### Placement (x,y rotation side)
C1  16.76,54.61 270 top
C2  12.45,54.61 90 top
C3  23.62,44.45 180 top
C4  21.59,5.08 180 top
C5  39.37,5.08 180 top
C6  57.15,5.08 180 top
C7  74.93,5.08 180 top
C8  92.71,5.08 180 top
C9  110.49,5.08 180 top
C10  127.25,5.08 180 top
C11  41.91,25.4 270 top
IC1  23.37,52.32 180 top
IC2  34.29,26.67 180 top
JP1  76.2,21.34 0 top
JP2  76.2,64.77 180 top
JP3  131.57,45.47 270 top
JP4  7.62,72.9 90 top
JP5  33.02,7.62 90 top
JP6  50.8,7.62 90 top
JP7  68.58,7.62 90 top
JP8  86.36,7.62 90 top
JP9  104.14,7.62 90 top
JP10  121.92,7.62 90 top
JP11  137.92,7.62 90 top
JP12  145.29,23.88 90 top
JP14  7.87,85.6 0 top
P1  16.76,26.92 270 top
R1  26.67,7.62 270 top
R2  44.45,7.62 270 top
R3  62.23,7.62 270 top
R4  80.01,7.62 270 top
R5  97.79,7.62 270 top
R6  115.57,7.62 270 top
R7  132.08,7.62 270 top
R8  3.3,85.34 270 top
R9  7.62,80.77 0 top
R10  16.51,46.99 90 top
R11  13.97,46.99 270 top
U1  16.76,83.82 90 top
U9  16.76,88.9 90 top
U$2  21.59,8.89 90 top
U$4  39.37,8.89 90 top
U$5  57.15,8.89 90 top
U$6  74.93,8.89 90 top
U$7  92.71,8.89 90 top
U$8  110.49,8.89 90 top
U$9  127.25,8.89 90 top
U$10  76.2,88.9 180 bottom
X1  6.1,50.8 0 top

### Tracks (layer width: path | path; a pad name or v marks a point on that pad's centre or on a via)
+3V3  (via drill 0.6, 0.61)
  Top 0.406: U$2.4 20.64,8.23 20.64,7.94 | U$7.4 91.76,8.23 | U$6.4 73.98,8.23 | JP8.3 87.63,10.16 | U$9.4 126.3,8.23 | U$8.4 109.54,8.23 | JP10.3 123.19,10.16 | U$4.4 38.42,8.23 | JP7.3 69.85,10.16 | 40.64,23.11 40.64,23.18 | 40.64,21.59 v40.39,21.34 | 105.41,10.16 JP9.3 | 34.29,10.16 JP5.3 | C11.2 41.91,24.38 | 40.92,23.6 41.02,23.5 | 56.2,5.09 55.88,5.09 55.88,5.08 | 56.21,5.09 56.2,5.09 | 56.2,5.09 C6.2
  Top 0.61: C4.2 20.64,7.94 | 91.76,8.23 C8.2 | 73.98,8.23 C7.2 | 87.63,10.16 89.55,8.24 U$7.4 | 126.3,8.23 C10.2 | U$8.4 107.33,8.24 105.41,10.16 | 109.54,8.23 C9.2 | 123.19,10.16 125.11,8.24 U$9.4 | 38.42,8.23 C5.2 | U$4.4 36.21,8.24 34.29,10.16 | 56.21,5.09 U$5.4 55.26,8.24 53.34,10.16 JP6.3 | 69.85,10.16 71.77,8.24 U$6.4 | 40.64,21.59 40.64,23.11 41.02,23.5 41.91,24.38 | IC2.14 40.92,23.6 | R9.2 9.14,80.77 | 9.14,80.77 v12.7,80.77 | R8.2 3.3,80.52 5.08,78.74 7.87,78.74 9.14,80.01 9.14,80.77 | v19.05,8.89 19.7,8.24 U$2.4
  Bottom 0.406: 50.42,10.54 JP6.3 | JP9.3 103.89,10.16
  Bottom 0.61: 19.05,12.7 30.48,12.7 JP5.3 35.56,12.7 | v19.05,8.89 19.05,12.7 | 35.56,12.7 48.26,12.7 50.42,10.54 52.58,12.7 66.04,12.7 JP7.3 71.12,12.7 83.82,12.7 JP8.3 88.9,12.7 101.35,12.7 103.89,10.16 | v40.39,21.34 33.02,13.97 34.29,12.7 35.56,12.7 | JP9.3 106.68,12.7 119.38,12.7 JP10.3 124.46,12.7 135.13,12.7 137.67,10.16 JP11.3 139.19,10.16 JP12.1 | v12.7,80.77 10.41,80.77 8.89,79.25 4.06,79.25 3.05,78.23 3.05,36.32 3.81,35.56 12.32,35.56 P1.1 22.1,25.78 22.1,15.75 19.05,12.7
+5V  (via drill 0.61)
  Top 0.406: IC1.20 22.39,44.73 C3.2
  Top 0.61: v129.03,11.18 129.03,14.22 130.3,15.49 148.34,15.49 149.1,16.26 149.1,29.46 148.34,30.23 JP12.11 | P1.2 12.95,30.73 12.95,32.77 22.67,42.48 C3.2
  Bottom 0.61: v129.03,11.18 129.03,6.35 125.98,3.3 19.56,3.3 17.78,5.08 17.78,13.97 20.32,16.51 20.32,23.37 P1.2
ANALOG_IN0  (via drill 0.6, 0.61)
  Top 0.406: v107.19,89.15 107.19,82.8 127.51,62.74 132.84,62.74 134.11,61.47 134.11,59.44 JP3.4 131.57,56.9 129.29,56.9 v128.27,55.88 | JP12.10 141.99,27.69 139.7,25.4 134.62,25.4 v132.08,22.86
  Bottom 0.406: 107.31,89.03 v107.19,89.15 107.19,91.9 U$10.A6 | v128.27,55.88 124.46,52.07 124.46,24.13 125.73,22.86 v132.08,22.86
ANALOG_IN1
  Bottom 0.406: JP3.1 130.3,63.25 128.78,64.77 120.65,64.77 107.44,77.98 107.44,85.65 U$10.B6
ANALOG_IN2  (via drill 0.6, 0.61)
  Top 0.406: v108.46,88.65 108.46,83.06 128.02,63.75 133.1,63.75 135.13,61.72 135.13,57.15 133.6,55.63 JP3.6 131.57,54.36 129.29,54.36 v128.27,53.34 | JP12.8 141.99,25.15 139.7,22.86 v137.16,22.86
  Bottom 0.406: U$10.A5 108.46,91.9 v108.46,88.65 | v137.16,22.86 135.89,24.13 127,24.13 125.73,25.4 125.73,50.8 v128.27,53.34
ANALOG_IN3
  Bottom 0.406: JP3.5 131.57,56.9 134.62,56.9 135.64,57.91 135.64,63.25 131.32,67.56 122.17,67.56 109.73,80.01 109.73,85.65 U$10.B4
ANALOG_IN4
  Bottom 0.406: JP3.3 131.57,59.44 131.57,64.01 129.79,65.79 121.67,65.79 108.46,78.99 108.46,84.58 108.71,84.84 108.46,85.09 108.46,85.85 108.58,85.72 | 108.71,85.6 108.58,85.72 | 108.58,85.72 U$10.B5
ANALOG_IN5  (via drill 0.6)
  Top 0.406: v111.25,88.65 111.25,83.31 128.02,66.55 136.91,66.55 138.43,65.02 138.43,52.58 136.4,50.55 JP3.10 131.57,49.28 129.54,49.28 129.29,49.28 v128.27,48.26 | JP12.4 143.26,20.07 140.97,17.78 v139.7,17.78
  Bottom 0.406: U$10.A3 111.25,91.9 v111.25,88.65 | v139.7,17.78 139.7,25.4 138.43,26.67 129.54,26.67 128.27,27.94 v128.27,48.26
ANALOG_IN6
  Bottom 0.406: JP3.7 130.81,53.09 132.08,54.36 135.38,54.36 137.16,56.13 137.16,64.26 132.08,69.34 122.68,69.34 111,81.03 111,85.65 U$10.B3
ANALOG_IN7  (via drill 0.6)
  Top 0.406: v109.98,89.15 109.98,83.06 128.27,65.28 135.38,65.28 136.65,64.01 136.65,55.12 134.62,53.09 JP3.8 131.57,51.82 129.29,51.82 v128.27,50.8 | JP12.6 141.99,22.61 139.7,20.32 v138.43,20.32
  Bottom 0.406: v109.98,89.15 109.98,91.9 U$10.A4 | v138.43,20.32 138.43,24.13 137.16,25.4 128.27,25.4 127,26.67 127,49.53 v128.27,50.8
GND  (via drill 0.6, 0.61)
  Top 0.406: 20.83,47.5 21.09,47.76 IC1.18 21.09,50.03 | IC1.25 25.64,47.76 25.65,47.75 | 25.65,47.75 25.65,49.78 | 23.04,49.97 IC1.21 23.04,47.82 23.11,47.75 23.11,47.24 23.37,46.99 25.65,46.99 25.65,47.75 | 23.04,49.97 23.11,50.04 | 21.09,50.03 21.08,50.04 | 21.09,50.03 22.98,50.03 23.04,49.97 | JP3.2 131.57,59.44 124.71,59.44 | IC1.7 23.69,58.09 v23.62,58.17
  Bottom 0.406: JP2.29 65.02,66.04 66.04,65.02 66.04,62.23 66.55,61.72 | JP2.11 88.9,64.77 88.9,62.48 89.15,62.23
  other vias: 28.45,26.67 60.2,81.28 20.32,46.99 13.97,55.88 15.24,55.88 26.67,44.45 13.97,49.53 30.48,81.28 69.09,81.28 77.98,81.28 87.12,81.28 96.01,81.28 105.41,81.28 25.4,81.28 20.32,76.2 25.4,76.2 30.48,76.2 35.56,76.2 15.24,76.2 15.24,81.28 25.4,86.36 30.48,86.36 45.72,81.28 40.64,81.28 40.64,96.52 35.56,96.52 30.48,96.52 30.48,91.44 25.4,96.52 25.4,91.44 20.32,96.52 15.24,96.52 15.24,91.44 20.32,81.28 20.32,86.36 20.32,91.44 20.32,60.96 5.08,60.96 5.08,66.04 10.16,60.96 5.08,40.64 10.16,40.64 15.24,40.64 30.48,50.8 40.64,50.8 40.64,45.72 35.56,45.72 25.4,40.64 20.32,35.56 30.48,40.64 40.64,35.56 45.72,35.56 45.72,30.48 40.64,30.48 5.08,15.24 10.16,15.24 15.24,15.24 15.24,10.16 25.4,15.24 116.84,66.04 116.84,60.96 116.84,81.28 121.92,81.28 121.92,76.2 127,76.2 127,71.12 132.08,71.12 127,96.52 132.08,96.52 137.16,96.52 137.16,91.44 132.08,91.44 137.16,86.36 142.24,86.36 147.32,86.36 147.32,81.28 142.24,81.28 147.32,76.2 121.92,60.96 127,60.96 111.76,55.88 116.84,55.88 121.92,55.88 106.68,50.8 111.76,50.8 116.84,50.8 106.68,45.72 106.68,40.64 106.68,35.56 106.68,30.48 106.68,25.4 111.76,15.24 116.84,15.24 121.92,15.24 106.68,15.24 101.6,15.24 96.52,15.24 15.24,60.96 30.48,45.72 35.56,40.64 45.72,25.4 20.32,30.48 60.2,82.55 69.09,82.55 77.98,82.55 87.12,82.55 96.01,82.55 105.41,82.55 137.16,13.97 139.7,13.97 146.05,13.97 148.59,13.97 111.76,45.72 111.76,40.64 111.76,35.56 116.84,45.72 121.92,50.8 121.92,45.72 121.92,40.64 116.84,40.64 116.84,35.56 121.92,35.56 111.76,30.48 111.76,25.4 116.84,25.4 116.84,30.48 121.92,30.48 121.92,25.4 121.92,20.32 116.84,20.32 111.76,20.32 106.68,20.32 40.64,40.64 45.72,45.72 45.72,40.64 45.72,20.32
  pour Top (isolate 0.406): 1.27,1.27 151.13,1.27 151.13,100.33 1.27,100.33
  pour Bottom (isolate 0.406): 1.27,1.27 151.13,1.27 151.13,100.33 1.27,100.33
GPIO_00  (via drill 0.61)
  Top 0.406: v54.1,89.41 54.1,82.3 41.66,69.85 41.66,59.94 53.34,48.26 53.34,21.34 JP1.1 51.82,20.07 50.04,21.84 50.04,47.75 39.37,58.42 39.37,78.74 35.24,82.87 U1.1 18.07,82.77 18.29,82.55 18.29,82.8
  Bottom 0.406: U$10.A48 53.98,89.53 v54.1,89.41
GPIO_0_IN0  (via drill 0.61)
  Top 0.406: JP1.2 52.07,48.01 40.39,59.69 40.39,70.61 | v52.83,88.65 52.83,83.06 40.39,70.61 | U9.1 31.68,87.95 40.39,79.25 40.39,70.61
  Bottom 0.406: U$10.A49 52.7,88.77 v52.83,88.65
GPIO_0_IN1  (via drill 0.61)
  Top 0.406: JP1.4 54.61,48.26 42.67,60.2 42.67,68.07 55.37,80.77 v55.37,88.65
  Bottom 0.406: U$10.A47 55.24,88.77 v55.37,88.65
GPIO_01  (via drill 0.61)
  Top 0.406: JP1.3 55.88,21.34 55.88,48.51 43.69,60.71 43.69,67.06 56.64,80.01 v56.64,89.41
  Bottom 0.406: U$10.A46 56.52,89.53 v56.64,89.41
GPIO_1_IN0
  Bottom 0.406: JP2.2 101.6,64.77 101.85,65.02 103.5,66.67 U$10.B9
GPIO_1_IN1
  Bottom 0.406: JP2.4 99.06,64.77 99.06,67.56 100.97,69.47 U$10.B11
GPIO_02  (via drill 0.61)
  Top 0.406: JP1.6 57.15,49.53 45.47,61.21 45.47,66.8 57.91,79.25 v57.91,88.65
  Bottom 0.406: U$10.A45 57.78,88.77 v57.91,88.65
GPIO_2_IN0  (via drill 0.6, 0.61)
  Top 0.406: v47.75,88.65 47.75,90.68 52.58,95.5 115.82,95.5 145.03,66.29 v145.03,45.97
  Bottom 0.406: v47.75,88.65 47.75,85.9 U$10.B53 | v145.03,45.97 145.03,35.56 139.7,30.23 JP3.26
GPIO_2_IN1  (via drill 0.6, 0.61)
  Top 0.406: v49.02,89.15 49.02,90.68 52.83,94.49 115.32,94.49 143.26,66.55 v143.26,45.97
  Bottom 0.406: v49.02,89.15 49.02,85.9 U$10.B52 | v143.26,45.97 143.26,35.81 138.94,31.5 131.06,31.5 130.3,32.26 JP3.23
GPIO_2_IN2  (via drill 0.6, 0.61)
  Top 0.406: v46.48,89.15 46.48,90.93 52.07,96.52 116.59,96.52 146.56,66.55 146.56,42.16 v146.3,41.91 | JP3.24 133.1,33.02 v145.03,33.02
  Bottom 0.406: v46.48,89.15 46.48,85.65 | 46.48,85.6 46.48,85.65 | 46.48,85.65 U$10.B54 | v145.03,33.02 146.05,34.04 146.05,41.66 v146.3,41.91
GPIO_03  (via drill 0.61)
  Top 0.406: JP1.5 58.42,21.34 58.42,50.04 46.74,61.72 46.74,66.29 59.18,78.74 v59.18,89.15
  Bottom 0.406: U$10.A44 59.05,89.28 v59.18,89.15
GPIO_04  (via drill 0.61)
  Top 0.406: JP1.8 59.69,51.05 48.26,62.48 48.26,66.04 61.47,79.25 v61.47,88.65
  Bottom 0.406: U$10.A42 61.59,88.77 v61.47,88.65
GPIO_05  (via drill 0.61)
  Top 0.406: JP1.7 60.96,21.34 60.96,52.07 50.04,62.99 50.04,66.55 62.99,79.25 62.99,89.15 v62.74,89.41
  Bottom 0.406: U$10.A41 62.87,89.53 v62.74,89.41
GPIO_06  (via drill 0.61)
  Top 0.406: JP1.10 62.23,53.85 53.34,62.74 53.34,67.06 64.01,77.22 v64.01,88.65
  Bottom 0.406: U$10.A40 64.14,88.77 v64.01,88.65
GPIO_07  (via drill 0.61)
  Top 0.406: JP1.9 63.5,21.34 63.5,55.12 55.88,62.74 55.88,66.8 65.28,75.44 v65.28,89.41
  Bottom 0.406: U$10.A39 65.41,89.53 v65.28,89.41
GPIO_08  (via drill 0.61)
  Top 0.406: JP1.14 67.31,53.85 58.42,62.74 58.42,67.31 67.06,74.93 67.06,88.14 v66.55,88.65
  Bottom 0.406: U$10.A38 66.67,88.77 v66.55,88.65
GPIO_09  (via drill 0.61)
  Top 0.406: JP1.13 68.58,21.34 68.58,54.86 60.96,62.48 60.96,67.56 68.07,74.17 v68.07,89.41
  Bottom 0.406: U$10.A37 67.94,89.53 v68.07,89.41
GPIO_010  (via drill 0.61)
  Top 0.406: JP1.16 69.85,56.13 63.5,62.48 63.5,67.31 70.36,74.17 v70.36,88.65
  Bottom 0.406: U$10.A35 70.48,88.77 v70.36,88.65
GPIO_10
  Bottom 0.406: JP2.1 101.35,66.04 101.85,66.55 102.23,66.93 U$10.B10
GPIO_011  (via drill 0.61)
  Top 0.406: JP1.15 71.12,21.34 71.12,57.4 66.04,62.48 66.04,67.82 71.63,73.15 v71.63,89.41
  Bottom 0.406: U$10.A34 71.75,89.53 v71.63,89.41
GPIO_11
  Bottom 0.406: U$10.B12 99.69,72.01 98.04,70.36 98.04,66.29 JP2.3
GPIO_012  (via drill 0.61)
  Top 0.406: JP1.18 72.39,58.93 68.58,62.74 68.58,68.58 72.9,72.39 v72.9,88.65
  Bottom 0.406: U$10.A33 73.03,88.77 v72.9,88.65
GPIO_12
  Bottom 0.406: JP2.6 96.52,64.77 96.52,72.64 98.42,74.55 U$10.B13
GPIO_013  (via drill 0.61)
  Top 0.406: JP1.17 73.66,21.34 73.66,59.94 71.12,62.48 71.12,69.34 74.17,72.14 v74.17,89.41
  Bottom 0.406: U$10.A32 74.3,89.53 v74.17,89.41
GPIO_13
  Bottom 0.406: U$10.B14 97.16,74.8 95.5,73.15 95.5,66.29 JP2.5
GPIO_014  (via drill 0.61)
  Top 0.406: JP1.20 74.93,60.96 73.66,62.23 73.66,69.34 75.44,70.87 v75.44,88.65
  Bottom 0.406: U$10.A31 75.56,88.77 v75.44,88.65
GPIO_14
  Bottom 0.406: JP2.8 93.98,64.77 93.98,67.82 94.61,68.45 U$10.B16
GPIO_015  (via drill 0.61)
  Top 0.406: JP1.19 76.2,21.34 76.2,67.06 76.71,67.82 v76.71,89.41
  Bottom 0.406: U$10.A30 76.83,89.53 v76.71,89.41
GPIO_15
  Bottom 0.406: U$10.B17 93.34,69.09 92.71,68.45 JP2.7
GPIO_016  (via drill 0.61)
  Top 0.406: JP1.22 77.47,61.21 78.61,62.36 78.74,62.48 78.74,66.8 79.25,67.31 v79.25,88.65
  Bottom 0.406: v79.25,88.65 79.25,90.93 79.5,91.19 79.5,91.9 U$10.A28
GPIO_16
  Bottom 0.406: JP2.10 91.44,64.77 91.44,68.96 92.08,69.6 U$10.B18
GPIO_017  (via drill 0.61)
  Top 0.406: JP1.21 78.74,21.59 78.74,60.2 81.28,62.74 81.28,68.07 80.52,68.83 80.52,89.15 v80.77,89.41
  Bottom 0.406: v80.77,89.41 80.77,91.9 U$10.A27
GPIO_17
  Bottom 0.406: U$10.B19 90.81,70.99 89.92,70.1 89.92,66.29 JP2.9
GPIO_018  (via drill 0.61)
  Top 0.406: JP1.24 80.01,58.93 83.82,62.74 83.82,68.58 82.04,70.36 v82.04,88.65
  Bottom 0.406: v82.04,88.65 82.04,91.9 U$10.A26
GPIO_18
  Bottom 0.406: JP2.14 86.36,64.77 86.36,68.33 87.88,69.85 88.14,70.1 89.53,71.5 U$10.B20
GPIO_019  (via drill 0.61)
  Top 0.406: JP1.23 81.28,21.34 81.28,57.66 86.36,62.74 86.36,68.58 83.31,71.63 v83.31,89.41
  Bottom 0.406: v83.31,89.41 83.31,91.9 U$10.A25
GPIO_19
  Bottom 0.406: JP2.13 85.09,68.07 86.49,69.47 87,69.98 88.27,71.25 U$10.B21
GPIO_020  (via drill 0.61)
  Top 0.406: JP1.26 82.55,56.39 88.9,62.74 88.9,67.56 84.58,71.88 v84.58,88.65
  Bottom 0.406: v84.58,88.65 84.58,91.9 U$10.A24
GPIO_20  (via drill 0.6, 0.61)
  Top 0.406: v50.29,88.65 50.29,90.42 53.59,93.47 114.81,93.47 141.73,66.55 v141.73,44.7
  Bottom 0.406: v50.29,88.65 50.29,85.9 U$10.B51 | v141.73,44.7 141.73,35.81 139.95,34.04 131.57,34.04 JP3.21
GPIO_021  (via drill 0.61)
  Top 0.406: JP1.25 83.82,21.34 83.82,55.12 91.44,62.74 91.44,66.8 85.85,72.39 v85.85,89.41
  Bottom 0.406: v85.85,89.41 85.85,91.95 85.8,91.95 U$10.A23
GPIO_21  (via drill 0.6, 0.61)
  Top 0.406: v45.21,88.65 45.21,90.93 51.56,97.28 117.35,97.28 147.83,66.8 v147.83,43.94 | JP3.22 v147.32,35.31
  Bottom 0.406: v45.21,88.65 45.21,85.85 45.13,85.78 | 45.13,85.78 44.96,85.6 | U$10.B55 45.13,85.78 | v147.83,43.94 147.83,35.81 v147.32,35.31
GPIO_022  (via drill 0.61)
  Top 0.406: JP1.28 85.09,53.85 93.98,62.74 93.98,66.8 88.39,72.9 v88.39,88.65
  Bottom 0.406: v88.39,88.65 88.39,91.9 U$10.A21
GPIO_22
  Bottom 0.406: U$10.A56 43.81,94.61 48.26,99.06 120.4,99.06 145.03,74.42 145.03,52.83 145.03,52.32 145.03,50.04 134.11,39.12 131.57,39.12 JP3.19
GPIO_023  (via drill 0.61)
  Top 0.406: JP1.27 86.36,21.34 86.36,52.58 96.52,62.74 96.52,66.8 89.66,74.42 v89.66,89.41
  Bottom 0.406: U$10.A20 89.53,89.53 v89.66,89.41
GPIO_23  (via drill 0.61)
  Top 0.406: v43.94,89.15 43.94,91.19 51.56,98.81 118.62,98.81 149.1,68.33 149.1,42.67 144.27,37.85 JP3.20
  Bottom 0.406: v43.94,89.15 43.94,85.9 U$10.B56
GPIO_024  (via drill 0.61)
  Top 0.406: JP1.32 90.17,53.85 99.06,62.74 99.06,67.31 90.93,75.69 v90.93,88.65
  Bottom 0.406: U$10.A19 90.81,88.77 v90.93,88.65 90.93,88.9
GPIO_24
  Bottom 0.406: U$10.A55 45.09,94.61 48.77,98.3 119.89,98.3 143.51,74.68 143.51,51.05 134.11,41.66 131.57,41.66 JP3.17
GPIO_025  (via drill 0.61)
  Top 0.406: JP1.31 91.44,21.34 91.44,52.58 101.85,62.99 101.85,66.8 92.2,76.45 v92.2,89.41
  Bottom 0.406: U$10.A18 92.08,89.53 v92.2,89.41
GPIO_25
  Top 0.406: JP12.9 145.29,26.42 141.99,26.42 139.7,24.13 135.89,24.13 133.35,21.59 130.81,21.59 128.27,24.13 128.27,37.59 129.79,39.12 131.57,39.12 JP3.18
GPIO_026  (via drill 0.61)
  Top 0.406: JP1.34 92.71,52.58 103.38,63.25 103.38,67.06 93.47,77.22 v93.47,88.65
  Bottom 0.406: U$10.A17 93.34,88.77 v93.47,88.65
GPIO_26
  Bottom 0.406: U$10.A54 46.35,94.61 49.28,97.54 119.38,97.54 142.49,74.42 142.49,52.32 134.37,44.2 131.32,44.2 130.3,43.18 JP3.15
GPIO_027  (via drill 0.61)
  Top 0.406: JP1.33 93.98,21.34 93.98,52.58 104.39,62.99 104.39,67.82 94.74,77.47 v94.74,89.41
  Bottom 0.406: U$10.A16 94.61,89.53 v94.74,89.41
GPIO_27
  Top 0.406: JP12.7 145.29,23.88 141.99,23.88 139.7,21.59 135.89,21.59 134.62,20.32 129.54,20.32 127,22.86 127,38.86 129.79,41.66 131.57,41.66 JP3.16
GPIO_028  (via drill 0.61)
  Top 0.406: JP1.36 95.25,52.32 105.41,62.48 105.41,68.58 97.28,76.71 v97.28,88.65
  Bottom 0.406: U$10.A14 arc-90 97.28,91.9 v97.28,88.65
GPIO_28
  Bottom 0.406: U$10.A53 47.62,94.61 49.78,96.77 118.87,96.77 141.22,74.42 141.22,53.59 134.37,46.74 131.57,46.74 JP3.13
GPIO_029  (via drill 0.61)
  Top 0.406: JP1.35 96.52,21.34 96.52,52.32 106.43,62.23 106.43,69.09 98.55,76.96 v98.55,89.41
  Bottom 0.406: U$10.A13 arc-45 98.55,91.72 v98.55,89.41
GPIO_29
  Top 0.406: JP12.5 145.29,21.34 141.99,21.34 139.7,19.05 128.27,19.05 125.73,21.59 125.73,40.64 129.29,44.2 131.57,44.2 JP3.14
GPIO_030  (via drill 0.61)
  Top 0.406: JP1.38 97.79,52.32 107.44,61.98 107.44,69.6 99.57,77.47 v99.57,88.65
  Bottom 0.406: U$10.A12 arc90 99.57,91.9 v99.57,88.65
GPIO_031  (via drill 0.61)
  Top 0.406: JP1.37 99.06,21.34 99.06,52.32 108.71,61.98 108.71,69.85 100.84,77.72 v100.84,89.15
  Bottom 0.406: U$10.A11 100.91,91.97 arc45 100.84,91.79 v100.84,89.15
GPIO_032  (via drill 0.61)
  Top 0.406: JP1.40 100.33,52.07 109.98,61.72 109.98,70.61 102.11,78.49 v102.11,88.65
  Bottom 0.406: U$10.A10 102.18,91.97 arc45 102.11,91.79 v102.11,88.65
GPIO_033  (via drill 0.61)
  Top 0.406: JP1.39 102.11,21.84 102.11,52.58 111,61.47 111,71.37 103.63,78.74 v103.63,89.15
  Bottom 0.406: v103.63,89.15 103.63,90.93 103.63,91.95 103.63,92.46 103.38,92.2 103.5,92.08 U$10.A9
GPIO_110
  Bottom 0.406: JP2.16 83.82,64.77 83.82,68.07 85.72,69.98 U$10.B23
GPIO_111
  Bottom 0.406: JP2.15 82.55,68.58 84.45,70.48 U$10.B24
GPIO_112
  Bottom 0.406: JP2.18 81.28,64.77 81.28,69.34 83.19,71.25 U$10.B25
GPIO_113
  Bottom 0.406: JP2.17 80.26,66.29 80.26,69.6 81.92,71.25 U$10.B26
GPIO_114
  Bottom 0.406: JP2.20 78.74,64.77 78.74,69.34 80.64,71.25 U$10.B27
GPIO_115
  Bottom 0.406: JP2.19 77.47,69.6 79.38,71.5 U$10.B28
GPIO_116
  Bottom 0.406: JP2.22 76.2,64.77 76.2,69.6 76.83,70.23 U$10.B30
GPIO_117
  Bottom 0.406: U$10.B31 75.56,70.74 74.93,70.1 JP2.21
GPIO_118
  Bottom 0.406: JP2.24 73.66,64.77 73.66,70.1 74.3,70.74 U$10.B32
GPIO_119
  Bottom 0.406: U$10.B33 73.03,71.12 72.9,71.12 72.39,70.61 JP2.23 72.14,65.79
GPIO_120
  Bottom 0.406: JP2.26 71.12,64.77 71.12,71.12 71.75,71.75 U$10.B34
GPIO_121
  Bottom 0.406: U$10.B35 70.48,72.14 69.85,71.5 JP2.25
GPIO_122
  Bottom 0.406: JP2.28 68.58,64.77 68.58,69.6 67.94,70.23 U$10.B37
GPIO_123
  Bottom 0.406: U$10.B38 66.67,66.67 JP2.27 | 67.06,66.04 JP2.27 | JP2.27 67.31,66.29
GPIO_124  (via drill 0.6, 0.61)
  Top 0.406: IC2.1 v38.1,34.29 | v38.1,54.61 v38.1,57.15
  Bottom 0.406: 62.23,60.71 62.23,60.96 | 62.23,60.96 JP2.32 63.5,64.77 63.5,67.31 65.28,69.09 65.28,85.09 65.41,85.22 U$10.B39 | v38.1,34.29 v38.1,54.61 | v38.1,57.15 58.42,57.15 62.23,60.96
GPIO_125
  Bottom 0.406: JP2.31 62.23,66.8 57.15,71.88 15.75,71.88 10.92,76.71 JP4.7
GPIO_126  (via drill 0.6)
  Top 0.406: IC1.1 27.59,56.8 29.21,58.42 v30.48,58.42
  Bottom 0.406: v30.48,58.42 57.15,58.42 59.69,60.96 JP2.34
GPIO_127
  Bottom 0.406: JP2.33 59.69,66.55 55.88,70.36 15.75,70.36 10.67,75.44 7.62,75.44 JP4.8
GPIO_128  (via drill 0.6)
  Top 0.406: IC1.3 26.29,58.04 27.94,59.69 v29.21,59.69
  Bottom 0.406: JP2.36 57.15,61.47 55.37,59.69 v29.21,59.69
GPIO_129
  Bottom 0.406: 57.4,66.29 JP2.35 57.15,66.55 54.61,69.09 15.24,69.09 10.41,73.91 9.14,73.91 JP4.5
GPIO_130  (via drill 0.6)
  Top 0.406: v27.94,60.96 26.67,60.96 24.99,59.28 IC1.5
  Bottom 0.406: JP2.38 54.61,62.23 53.34,60.96 v27.94,60.96
GPIO_131
  Bottom 0.406: JP2.37 53.09,67.56 15.24,67.56 10.16,72.9 7.62,72.9 JP4.6
GPIO_132  (via drill 0.6)
  Top 0.406: v26.67,62.23 24.13,62.23 21.09,59.19 IC1.11
  Bottom 0.406: JP2.40 50.8,62.23 v26.67,62.23
GPIO_133
  Bottom 0.406: JP2.39 14.22,66.04 9.91,70.36 7.62,70.36 JP4.4
GPIO_210
  Bottom 0.406: U$10.A52 48.77,92.15 48.77,94.49 50.29,96.01 118.36,96.01 139.95,74.42 139.95,55.37 134.11,49.53 133.86,49.53 133.6,49.28 131.06,49.28 130.3,48.51 JP3.11
GPIO_211
  Top 0.406: JP12.3 145.29,18.8 143.26,18.8 140.97,16.51 128.27,16.51 124.46,20.32 124.46,41.4 129.79,46.74 131.57,46.74 JP3.12
GPIO_212
  Bottom 0.406: U$10.A51 50.16,94.36 51.05,95.25 117.86,95.25 138.68,74.42 138.68,55.88 134.62,51.82 131.57,51.82 JP3.9 130.05,50.55
N$1
  Top 0.406: IC1.17 20.44,50.68 | IC1.4 25.64,53.84 22.86,51.05 20.82,51.05 20.44,50.68 | C1.2 17.46,53.66 20.44,50.68
N$2
  Top 0.406: R1.S 23.15,7.62 U$2.1
N$3
  Top 0.406: R2.S 40.93,7.62 U$4.1
N$8
  Top 0.406: R3.S 58.71,7.62 U$5.1
N$9
  Top 0.406: R4.S 76.49,7.62 U$6.1
N$10
  Top 0.406: R5.S 94.27,7.62 U$7.1
N$11
  Top 0.406: R6.S 112.05,7.62 U$8.1
N$12
  Top 0.406: R7.S 128.81,7.62 U$9.1
N$13
  Top 0.61: R8.1 3.43,86.87 JP14.2
N$14
  Top 0.406: U9.3 11.18,88.9 JP14.4
N$24
  Top 0.61: R9.1 6.22,83.94 JP14.1
N$25
  Top 0.406: U1.3 9.65,83.82 JP14.3
N$27
  Top 0.406: R11.2 R10.1 16.83,45.72 20.83,45.72 21.74,46.63 IC1.19
TEMP1
  Top 0.406: JP5.2 30.48,7.62 R1.E
TEMP1_ERR
  Top 0.406: IC2.3 35.56,34.29 34.29,35.56 25.4,35.56 24.13,34.29 24.13,19.05 20.65,15.57 U$2.3
TEMP2
  Top 0.406: JP6.2 48.26,7.62 R2.E
TEMP2_ERR
  Top 0.406: U$4.3 37.45,9.54 25.4,21.59 25.4,33.02 26.67,34.29 33.02,34.29 34.29,33.02 IC2.4
TEMP3
  Top 0.406: JP7.2 66.04,7.62 R3.E
TEMP3_ERR
  Top 0.406: U$5.3 56.21,11.1 54.61,12.7 36.83,12.7 26.67,22.86 26.67,31.75 27.94,33.02 31.75,33.02 33.02,31.75 IC2.5
TEMP4
  Top 0.406: JP9.2 101.6,7.62 R5.E
TEMP4_ERR
  Top 0.406: U$7.3 91.77,13.64 90.17,15.24 39.37,15.24 33.02,21.59 IC2.10
TEMP5
  Top 0.406: JP10.2 119.38,7.62 R6.E
TEMP5_ERR
  Top 0.406: U$8.3 109.55,14.91 107.95,16.51 39.37,16.51 34.29,21.59 IC2.11
TEMP6
  Top 0.406: JP8.2 83.82,7.62 R4.E
TEMP6_ERR
  Top 0.406: U$6.3 73.99,12.37 72.39,13.97 39.37,13.97 31.75,21.59 IC2.9
TEMP7
  Top 0.406: JP11.2 135.38,7.62 R7.E
TEMP7_ERR
  Top 0.406: U$9.3 126.32,15.92 124.46,17.78 39.37,17.78 35.56,21.59 IC2.12
TEMP_INT_ERR
  Top 0.406: IC2.13 IC2.2
USB_5V  (via drill 0.6)
  Top 0.406: X1.VBUS 11.19,52.4 C2.1 13.65,53.66 v13.97,53.34 | R10.2 v16.51,49.53
  Bottom 0.406: v13.97,53.34 16.51,50.8 v16.51,49.53
USBDM
  Top 0.406: X1.D- 18.25,51.6 19.81,50.04 19.81,48.77 | 19.81,48.77 19.81,48.51 | IC1.16 19.79,48.75 19.81,48.77
USBDP
  Top 0.406: X1.D+ 17.53,50.8 19.14,49.18 IC1.15
VCC_3P3
  Bottom 0.406: 130.56,30.23 JP3.25
  Bottom 0.61: 130.56,30.23 130.56,29.46 132.08,27.94 139.7,27.94 140.97,26.67 140.97,19.05 142.49,17.53 JP12.2
VCC_3P3_1
  Bottom 0.61: JP4.2 6.35,68.58 7.62,67.31 10.16,67.31 12.7,64.77 21.59,64.77 30.48,55.88 59.69,55.88 64.77,60.96 JP2.30
VCC_SYS_0
  Bottom 0.406: 65.02,22.86 JP1.12

### Text on the board
tNames: IR LED | PM Connector | USB to Serial | Power In | IMU Connector | MDA Interface Board Rev01 - Jan '12 | Temp Sense